# Altium project Sandshark 3D.PrjPcb
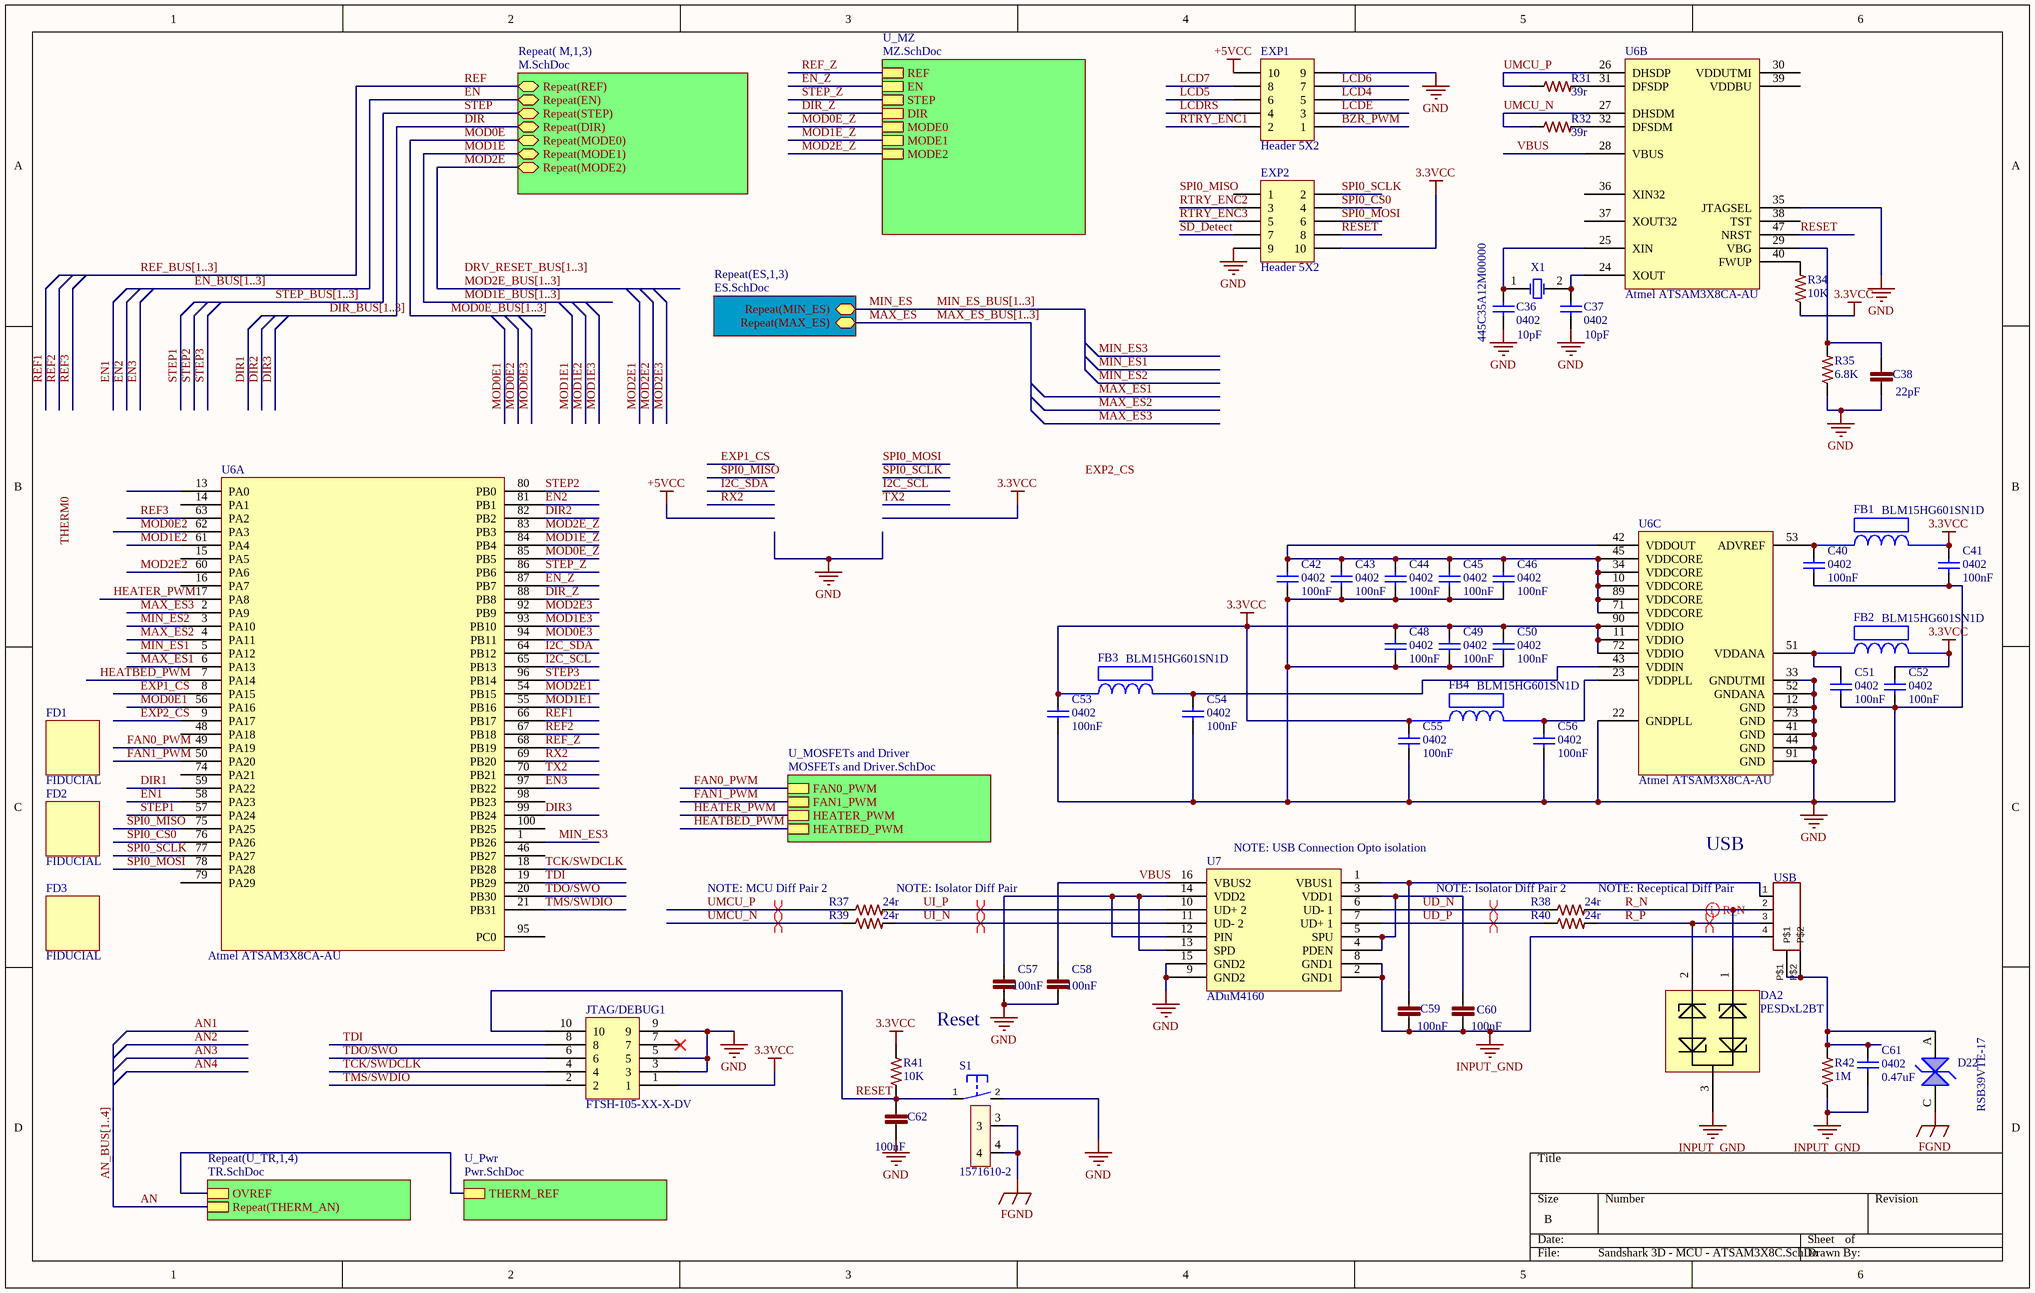
[diagram p0: Sandshark 3D - MCU - ATSAM3X8C.SchDoc]
7 sheets, 281 parts. Net scope: hierarchical (ports join the sheet entries above them; power ports are global).
Board file: Sandshark 3D R1.2.PcbDoc
Sheets:
  Sandshark 3D - MCU - ATSAM3X8C.SchDoc
    U_MZ = MZ.SchDoc
    M1 = M.SchDoc
    M2 = M.SchDoc
    M3 = M.SchDoc
    ES1 = ES.SchDoc
    ES2 = ES.SchDoc
    ES3 = ES.SchDoc
    U_MOSFETs and Driver = MOSFETs and Driver.SchDoc
    U_TR1 = TR.SchDoc
    U_TR2 = TR.SchDoc
    U_TR3 = TR.SchDoc
    U_TR4 = TR.SchDoc
    U_Pwr = Pwr.SchDoc

## Sheet Sandshark 3D - MCU - ATSAM3X8C.SchDoc
size B

### Parts
C36  0402  value 10pF  [C0402]
C37  0402  value 10pF  [C0402]
C38  22pF  [C0402]
C40  value 100nF  [C0402]  (hidden comment: 0402)
C41  value 100nF  [C0402]  (hidden comment: 0402)
C42  value 100nF  [C0402]  (hidden comment: 0402)
C43  value 100nF  [C0402]  (hidden comment: 0402)
C44  value 100nF  [C0402]  (hidden comment: 0402)
C45  value 100nF  [C0402]  (hidden comment: 0402)
C46  value 100nF  [C0402]  (hidden comment: 0402)
C48  value 100nF  [C0402]  (hidden comment: 0402)
C49  value 100nF  [C0402]  (hidden comment: 0402)
C50  value 100nF  [C0402]  (hidden comment: 0402)
C51  value 100nF  [C0402]  (hidden comment: 0402)
C52  value 100nF  [C0402]  (hidden comment: 0402)
C53  value 100nF  [C0402]  (hidden comment: 0402)
C54  value 100nF  [C0402]  (hidden comment: 0402)
C55  value 100nF  [C0402]  (hidden comment: 0402)
C56  value 100nF  [C0402]  (hidden comment: 0402)
C57  100nF  [C0402]
C58  100nF  [C0402]
C59  100nF  [C0402]
C60  100nF  [C0402]
C61  value 0.47uF  [C0402]  (hidden comment: 0402)
C62  100nF  [C0402]
D22  RSB39VTE-17  [SOD323-R]
DA2  PESDxL2BT  [SOT95P230X110-3N]
EXP1  Header 5X2  [HDR2X5]
EXP2  Header 5X2  [HDR2X5]
FB1  BLM15HG601SN1D  [BLM18PG121SN1D]
FB2  BLM15HG601SN1D  [BLM18PG121SN1D]
FB3  BLM15HG601SN1D  [BLM18PG121SN1D]
FB4  BLM15HG601SN1D  [BLM18PG121SN1D]
FD1  FIDUCIAL  [FIDUCIAL-1X2]
FD2  FIDUCIAL  [FIDUCIAL-1X2]
FD3  FIDUCIAL  [FIDUCIAL-1X2]
JTAG/DEBUG1  FTSH-105-XX-X-DV  [FTSH-105-XX-X-DV]
R31  39r  [R0402]
R32  39r  [R0402]
R34  10K  [R0603]
R35  6.8K  [R0402]
R37  24r  [R0603]
R38  24r  [R0603]
R39  24r  [R0603]
R40  24r  [R0603]
R41  10K  [R0603]
R42  1M  [R0402]
S1  1571610-2  [B3F-31XX]
U6  Atmel ATSAM3X8CA-AU  [ATSAM3X8CA-AU TQFP100]  (parts A,B,C of 3)
U7  ADuM4160  [ADUM4160BRWZ-RL]
USB  USB-B  [PN61729]  (value not drawn)
X1  445C35A12M00000  [445C35A12M00000]

### Sub-sheets
Repeat( M,1,3) = M.SchDoc: Repeat(REF), Repeat(EN), Repeat(STEP), Repeat(DIR), Repeat(MODE0), Repeat(MODE1), Repeat(MODE2)
Repeat(ES,1,3) = ES.SchDoc: Repeat(MAX_ES), Repeat(MIN_ES)
Repeat(U_TR,1,4) = TR.SchDoc: OVREF, Repeat(THERM_AN)
U_MOSFETs and Driver = MOSFETs and Driver.SchDoc: FAN0_PWM, FAN1_PWM, HEATER_PWM, HEATBED_PWM
U_MZ = MZ.SchDoc: REF, EN, STEP, DIR, MODE0, MODE1, MODE2
U_Pwr = Pwr.SchDoc: THERM_REF

### Nets
3.3VCC: C41.2 C48.2 C49.2 C50.2 C52.2 C53.2 C55.2 EXP2.10 FB1.2 FB2.2 FB3.1 FB4.1 JTAG/DEBUG1.1 R34.1 R41.2 U6.11(VDDIO) U6.72(VDDIO) U6.90(VDDIO)
+5VCC: EXP1.10
FGND: D22.C S1.3 S1.4
GND: C36.1 C37.1 C38.2 C40.1 C41.1 C42.1 C43.1 C44.1 C45.1 C46.1 C48.1 C49.1 C50.1 C51.1 C52.1 C53.1 C54.1 C55.1 C56.1 C57.2 C58.2 C62.2 EXP1.9 EXP2.9 JTAG/DEBUG1.3 JTAG/DEBUG1.5 JTAG/DEBUG1.9 R35.1 S1.2(S) U6.12(GND) U6.22(GNDPLL) U6.33(GNDUTMI) U6.35(JTAGSEL) U6.41(GND) U6.44(GND) U6.52(GNDANA) U6.73(GND) U6.91(GND) U7.9(GND2) U7.15(GND2)
INPUT_GND: C59.2 C60.2 C61.1 DA2.3 R42.1 U7.2(GND1) U7.8(GND1) USB.4
AN: sheet Repeat(U_TR,1,4)/Repeat(THERM_AN)
BZR_PWM: EXP1.1
DIR: sheet Repeat( M,1,3)/Repeat(DIR)
DIR1: U6.59(PA22)
DIR2: U6.82(PB2)
DIR3: U6.99(PB24)
DIR_Z: U6.88(PB8) ; sheet U_MZ/DIR
EN: sheet Repeat( M,1,3)/Repeat(EN)
EN1: U6.58(PA23)
EN2: U6.81(PB1)
EN3: U6.97(PB22)
EN_Z: U6.87(PB7) ; sheet U_MZ/EN
EXP1_CS: U6.8(PA15)
EXP2_CS: U6.9(PA17)
FAN0_PWM: U6.49(PA19) ; sheet U_MOSFETs and Driver/FAN0_PWM
FAN1_PWM: U6.50(PA20) ; sheet U_MOSFETs and Driver/FAN1_PWM
HEATBED_PWM: U6.7(PA14) ; sheet U_MOSFETs and Driver/HEATBED_PWM
HEATER_PWM: U6.17(PA8) ; sheet U_MOSFETs and Driver/HEATER_PWM
I2C_SCL: U6.65(PB13)
I2C_SDA: U6.64(PB12)
LCD4: EXP1.5
LCD5: EXP1.6
LCD6: EXP1.7
LCD7: EXP1.8
LCDE: EXP1.3
LCDRS: EXP1.4
MAX_ES: sheet Repeat(ES,1,3)/Repeat(MAX_ES)
MAX_ES1: U6.6(PA13)
MAX_ES2: U6.4(PA11)
MAX_ES3: U6.2(PA9)
MIN_ES: sheet Repeat(ES,1,3)/Repeat(MIN_ES)
MIN_ES1: U6.5(PA12)
MIN_ES2: U6.3(PA10)
MIN_ES3: U6.1(PB26)
MOD0E: sheet Repeat( M,1,3)/Repeat(MODE0)
MOD0E1: U6.56(PA16)
MOD0E2: U6.62(PA3)
MOD0E3: U6.94(PB11)
MOD0E_Z: U6.85(PB5) ; sheet U_MZ/MODE0
MOD1E: sheet Repeat( M,1,3)/Repeat(MODE1)
MOD1E1: U6.55(PB16)
MOD1E2: U6.61(PA4)
MOD1E3: U6.93(PB10)
MOD1E_Z: U6.84(PB4) ; sheet U_MZ/MODE1
MOD2E: sheet Repeat( M,1,3)/Repeat(MODE2)
MOD2E1: U6.54(PB15)
MOD2E2: U6.60(PA6)
MOD2E3: U6.92(PB9)
MOD2E_Z: U6.83(PB3) ; sheet U_MZ/MODE2
R_N: DA2.1 R38.2 USB.2
R_P: DA2.2 R40.2 USB.3
REF: sheet Repeat( M,1,3)/Repeat(REF)
REF1: U6.66(PB17)
REF2: U6.67(PB18)
REF3: U6.63(PA2)
REF_Z: U6.68(PB19) ; sheet U_MZ/REF
RESET: C62.1 EXP2.8 JTAG/DEBUG1.10 R41.1 S1.1(P) U6.47(NRST)
RTRY_ENC1: EXP1.2
RTRY_ENC2: EXP2.3
RTRY_ENC3: EXP2.5
RX2: U6.69(PB20)
SD_Detect: EXP2.7
SPI0_CS0: EXP2.4 U6.76(PA26)
SPI0_MISO: U6.75(PA25)
SPI0_MOSI: EXP2.6 U6.78(PA28)
SPI0_SCLK: EXP2.2 U6.77(PA27)
STEP: sheet Repeat( M,1,3)/Repeat(STEP)
STEP1: U6.57(PA24)
STEP2: U6.80(PB0)
STEP3: U6.96(PB14)
STEP_Z: U6.86(PB6) ; sheet U_MZ/STEP
TCK/SWDCLK: JTAG/DEBUG1.4 U6.18(PB28)
TDI: JTAG/DEBUG1.8 U6.19(PB29)
TDO/SWO: JTAG/DEBUG1.6 U6.20(PB30)
TMS/SWDIO: JTAG/DEBUG1.2 U6.21(PB31)
TX2: U6.70(PB21)
UD_N: R38.1 U7.6(UD-_1)
UD_P: R40.1 U7.7(UD+_1)
UI_N: R39.2 U7.11(UD-_2)
UI_P: R37.2 U7.10(UD+_2)
UMCU_N: R32.1 R39.1 U6.27(DHSDM)
UMCU_P: R31.1 R37.1 U6.26(DHSDP)
VBUS: C58.1 U6.28(VBUS) U7.16(VBUS2)
NetC36_2: C36.2 U6.25(XIN) X1.1(OSC1)
NetC37_2: C37.2 U6.24(XOUT) X1.2(OSC2)
NetC38_1: C38.1 R35.2 U6.29(VBG)
NetC40_2: C40.2 FB1.1 U6.53(ADVREF)
NetC42_2: C42.2 C43.2 C44.2 C45.2 C46.2 U6.10(VDDCORE) U6.34(VDDCORE) U6.42(VDDOUT) U6.45(VDDCORE) U6.71(VDDCORE) U6.89(VDDCORE)
NetC51_2: C51.2 FB2.1 U6.51(VDDANA)
NetC54_2: C54.2 FB3.2 U6.43(VDDIN)
NetC56_2: C56.2 FB4.2 U6.23(VDDPLL)
NetC57_1: C57.1 U7.12(PIN) U7.13(SPD) U7.14(VDD2)
NetC59_1: C59.1 U7.1(VBUS1) USB.1
NetC60_1: C60.1 U7.3(VDD1) U7.4(PDEN) U7.5(SPU)
NetC61_2: C61.2 D22.A R42.2 USB.P$1 USB.P$2
NetD18_C: sheet Repeat(U_TR,1,4)/OVREF, sheet U_Pwr/THERM_REF
NetR31_2: R31.2 U6.31(DFSDP)
NetR32_2: R32.2 U6.32(DFSDM)
NetR34_2: R34.2 U6.40(FWUP)

Not connected (* = marked no-connect by the designer): EXP2 1; JTAG/DEBUG1 7*; U6 13(PA0) 14(PA1) 15(PA5) 16(PA7) 30(VDDUTMI) 36(XIN32) 37(XOUT32) 38(TST) 39(VDDBU) 46(PB27) 48(PA18) 74(PA21) 79(PA29) 95(PC0) 98(PB23) 100(PB25)

### Buses and harness runs
bus AN_BUS[1..4]
bus DIR_BUS[1..3]
bus DRV_RESET_BUS[1..3]
bus EN_BUS[1..3]
bus MAX_ES_BUS[1..3]
bus MIN_ES_BUS[1..3]
bus MOD0E_BUS[1..3]
bus MOD1E_BUS[1..3]
bus MOD2E_BUS[1..3]
bus REF_BUS[1..3]
bus STEP_BUS[1..3]

### Layout directives
differential pair: R_N, R_P, UD_N, UD_P, UI_N, UI_P, UMCU_N, UMCU_P

### Notes on the sheet
- NOTE: MCU Diff Pair 2
- NOTE: Isolator Diff Pair
- (near U7) NOTE: USB Connection Opto isolation
- (near R38) NOTE: Isolator Diff Pair 2
- NOTE: Receptical Diff Pair
- USB
- (near C57) Reset
- Labels drawn without touching a wire or pin: DRV_RESET_BUS[1..3], EXP2_CS, SPI0_MISO, THERM0

### Library data of the parts
C36 C37 = CL05C100JB5NNNC: CAP CER 10PF 50V 5% NP0 0402; MFR: Samsung; Tolerance: 10%; Voltage: 50VDC; Published: 10 - Dec - 2014; LatestRevisionDate: 10 - Dec - 2014; LatestRevisionNote: Ultimachine Footprint Added; Publisher: Ultimachine; Component Type: Chip Capacitor; MFR Part #: CL05C100JB5NNNC; Part Description: CAP CER 10PF 50V 5% NP0 0402; Mounting Type: SMT 0402; Datasheet: http://www.samsungsem.com/kr/front/downloadcms.do?path=/kr/support/product-search/mlcc/__icsFiles/afieldfile/2014/11/05&fileName=S_CL05C100JB5NNNC.pdf; Height: 0.55mm; PackageReference: 0402
C38 = 04025A220JAT2A: CAP CER 0402 22pF 50V 5% C0G; LastRevisionNote: ImportComponents; Published: 23-Apr-2014; Publisher: UltiMachine; LastRevisionDate: 23-Apr-2014; ManufacturerPartNumber: 04025A220JAT2A; VALUE: 22pF
C40-C46 C48-C56 = GRM155R71C104KA88D: CAP CER 0.1UF (100nF) 16V 10% X7R 0402; MFR: Murata; Part Description: CAP CER 0.1UF 16V 10% X7R 0402; Published: 10 - Dec - 2014; LatestRevisionDate: 10 - Dec - 2014; LatestRevisionNote: Ultimachine Footprint Added; Publisher: Ultimachine; Component Type: Chip Capacitor; MFR Part #: GRM155R71C104KA88D; Mounting Type: SMT 0402; Datasheet: http://psearch.murata.com/capacitor/product/GRM155R71C104KA88%23.pdf; Height: 0.5 ±0.05mm; Tolerance: 10%; Voltage: 16v; PackageReference: 0402
C57-C60 C62 = GRM155R71C104KA88D: CAP CER 0402 100nF 16V 10% X7R; LastRevisionNote: ImportComponents; Published: 23-Apr-2014; Publisher: UltiMachine; LastRevisionDate: 23-Apr-2014; ManufacturerPartNumber: GRM155R71C104KA88D; VALUE: 100nF
C61 = GRM155R60J474KE19D: 0.47uF 6.3v C0402 - GRM155R60J474KE19D; MFR: Murata; Part Description: CAP CER 0.47UF 6.3V 10% X5R 0402; Tolerance: 10%; Voltage: 6.3VDC; Published: 10 - Dec - 2014; LatestRevisionDate: 10 - Dec - 2014; LatestRevisionNote: Ultimachine Footprint Added; Publisher: Ultimachine; Component Type: Chip Capacitor; MFR Part #: GRM155R60J474KE19D; Mounting Type: SMT 0402; Datasheet: http://search.murata.co.jp/Ceramy/image/img/A01X/G101/ENG/GRM155R60J474KE19-01.pdf; Height: 0.5 ±0.05mm; PackageReference: 0402
D22 = RSB39VTE-17: DIODE TVS
DA2 = PESDxL2BT: PESDxL2BT TVS Diode Array 2x
EXP1 EXP2 = Header 5X2: Header, 5-Pin, Dual row; LatestRevisionDate: 17-Jul-2002; LatestRevisionNote: Re-released for DXP Platform.; Publisher: Altium Limited
JTAG/DEBUG1 = ARM Cortex JTAG-DEBUG Header
R31 R32 = ERJ-2RKF39R0X: RES SMD 39 OHM 1% 1/10W 0402; Manufacturer: Panasonic; LastRevisionNote: ImportComponents; Published: 23-Apr-2014; Publisher: UltiMachine; LastRevisionDate: 23-Apr-2014; ManufacturerPartNumber: ERJ-2RKF39R0X; Height: 0.4mm; VALUE: 39r
R34 R41 = ERJ-3EKF1002V: RES 0603 10K 100mW 1%; LastRevisionNote: ImportComponents; Published: 23-Apr-2014; Publisher: UltiMachine; LastRevisionDate: 23-Apr-2014; ManufacturerPartNumber: ERJ-3EKF1002V; VALUE: 10K
R35 = CRCW04026K80FKED: RES SMD 6.8K OHM 1% 1/16W 0402; Manufacturer: Vishay Dale; LastRevisionNote: ImportComponents; Published: 23-Apr-2014; Publisher: UltiMachine; LastRevisionDate: 23-Apr-2014; ManufacturerPartNumber: CRCW04026K80FKED; Height: 0.4mm; VALUE: 6.8K
R37-R40 = RC1608F240CS: RES SMD 24 OHM 1% 1/10W 0603; Manufacturer: Samsung; ManufacturerPartNumber: RC0603FR-07100KL; LastRevisionNote: ImportComponents; Published: 23-Apr-2014; Publisher: UltiMachine; LastRevisionDate: 23-Apr-2014; VALUE: 24r; PDF: http://www.samsungsem.com/global/support/library/product-catalog/__icsFiles/afieldfile/2015/01/12/CHIP_RESISTOR_150112_1.pdf
R42 = ERJ2GEJ105X: RES 0402 1M 100mW 5%; LastRevisionNote: ImportComponents; Published: 23-Apr-2014; Publisher: UltiMachine; LastRevisionDate: 23-Apr-2014; ManufacturerPartNumber: ERJ2GEJ105X; VALUE: 1M
S1 = 1571610-2_1: SWTCH Momentary Washable; Manufacturer: Omron; Manufacturer: TE; LastRevisionNote: Import; ComponentLink1URL: http://www.te.com/commerce/DocumentDelivery/DDEController?Action=srchrtrv&DocNm=1571610&DocType=Customer+Drawing&DocLang=English; ComponentLink1Description: Datasheet for B3F-31XX; Published: 23-Apr-2014; Publisher: UltiMachine; LastRevisionDate: 23-Apr-2014; ManufacturerPartNumber: 1571610-2; Supplier 1: Mouser; Supplier Part Number 1: 506-1571610-2
U6 = ATML-ATSAM3X8CA-AU-LQFP-100: Atmel ARM Cortex M3 MCU ATSAM3X8CA-AU; Manufacture: Atmel; Manufacture Part #: ATSAM3X8CA-AU; Type: ARM Cortex M3 Microcontroller; Mounting Type: SMT TQFP; Package Type: TQFP100; Datasheet: http://www.atmel.com/Images/doc11057s.pdf
U7 = ADuM4160: ADI iCoupler - USB 2.0 Galvanic Isolator
USB = USB-B: USB connector B PTH; LastRevisionNote: ImportComponents; Published: 23-Apr-2014; Publisher: UltiMachine; LastRevisionDate: 23-Apr-2014
X1 = XTAL: Crystal Oscillator; Published: 8-Jun-2000; LatestRevisionDate: 17-Jul-2002; LatestRevisionNote: Re-released for DXP Platform.; PackageReference: R38; Publisher: Altium Limited; PackageDescription: Crystal, Thru-Hole; 2 Leads; Body 3.1 x 8.2 mm (Dia.xH)

## Sheet MZ.SchDoc
size A
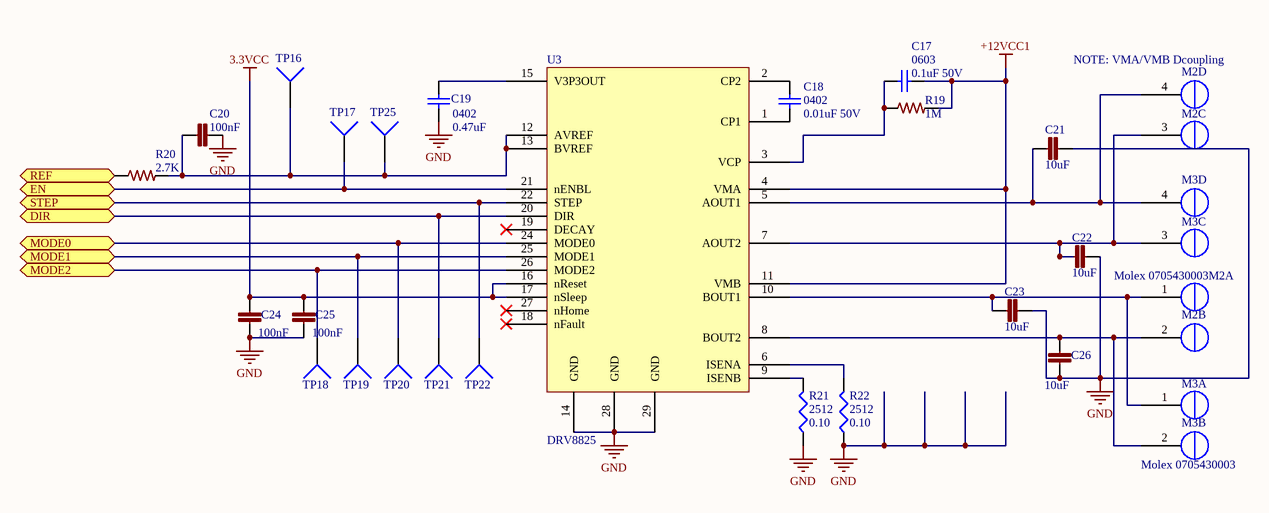
[diagram p1: MZ.SchDoc]

### Parts
C17  0603  value 0.1uF 50V  [1608[0603]]
C18  value 0.01uF 50V  [C0402]  (hidden comment: 0402)
C19  value 0.47uF  [C0402]  (hidden comment: 0402)
C20  100nF  [C0402]
C21  10uF  [C0603]
C22  10uF  [C0603]
C23  10uF  [C0603]
C24  100nF  [C0402]
C25  100nF  [C0402]
C26  10uF  [C0603]
M2  Molex 0705430003  [4POL254]  (parts A,B,C,D of 4)
M3  Molex 0705430003  [4POL254]  (parts A,B,C,D of 4)
R19  1M  [R0402]
R20  2.7K  [R0402]
R21  2512  value 0.10  [2512R-0.55]
R22  2512  value 0.10  [2512R-0.55]
TP16  TP4  [TP-2]  (value not drawn)
TP17  TP4  [TP-2]  (value not drawn)
TP18  TP4  [TP-2]  (value not drawn)
TP19  TP4  [TP-2]  (value not drawn)
TP20  TP4  [TP-2]  (value not drawn)
TP21  TP4  [TP-2]  (value not drawn)
TP22  TP4  [TP-2]  (value not drawn)
TP25  TP4  [TP-2]  (value not drawn)
U3  DRV8825  [DRV8825PWPR]

### Ports
DIR, EN, MODE0, MODE1, MODE2, REF, STEP

### Nets
3.3VCC: C24.1 C25.1 U3.16(nReset) U3.17(nSleep)
+12VCC1: C17.1 R19.2 U3.4(VMA) U3.11(VMB)
GND: C19.1 C20.2 C21.2 C22.2 C23.2 C24.2 C25.2 C26.2 R21.1 R22.1 U3.14(GND) U3.28(GND) U3.29(GND)
DIR_Z: TP21.1 U3.20(DIR) ; port DIR
EN_Z: TP17.1 U3.21(nENBL) ; port EN
MOD0E_Z: TP20.1 U3.24(MODE0) ; port MODE0
MOD1E_Z: TP19.1 U3.25(MODE1) ; port MODE1
MOD2E_Z: TP18.1 U3.26(MODE2) ; port MODE2
REF_Z: R20.1 ; port REF
STEP_Z: TP22.1 U3.22(STEP) ; port STEP
NetC17_2: C17.2 R19.1 U3.3(VCP)
NetC18_1: C18.1 U3.1(CP1)
NetC18_2: C18.2 U3.2(CP2)
NetC19_2: C19.2 U3.15(V3P3OUT)
NetC20_1: C20.1 R20.2 TP16.1 TP25.1 U3.12(AVREF) U3.13(BVREF)
NetC21_1: C21.1 M2.4(OUT1B) M3.4(OUT1B) U3.5(AOUT1)
NetC22_1: C22.1 M2.3(OUT1A) M3.3(OUT1A) U3.7(AOUT2)
NetC23_1: C23.1 M2.1(OUT2B) M3.1(OUT2B) U3.10(BOUT1)
NetC26_1: C26.1 M2.2(OUT2A) M3.2(OUT2A) U3.8(BOUT2)
NetR21_2: R21.2 U3.9(ISENB)
NetR22_2: R22.2 U3.6(ISENA)

Not connected (* = marked no-connect by the designer): U3 18(nFault)* 19(DECAY)* 23(NC) 27(nHome)*

### Notes on the sheet
- (near M2) NOTE: VMA/VMB Dcoupling

### Library data of the parts
C17 = Cap Semi: Capacitor (Semiconductor SIM Model); Published: 8-Jun-2000; LatestRevisionDate: 29-May-2009; LatestRevisionNote: IPC-7351 Footprint Added.; PackageReference: C1206; Publisher: Altium Limited; PackageDescription: Chip Capacitor
C18 = GRM155R71H103JA88D: CAP CER 10000PF 50V X7R 0402; MFR: Murata; Tolerance: 10%; Voltage: 6.3VDC; Published: 10 - Dec - 2014; LatestRevisionDate: 10 - Dec - 2014; LatestRevisionNote: Ultimachine Footprint Added; Publisher: Ultimachine; Component Type: Chip Capacitor; MFR Part #: GRM155R71H103JA88D; Part Description: CAP CER 10000PF 50V X7R 0402; Mounting Type: SMT 0402; Datasheet: http://search.murata.co.jp/Ceramy/image/img/A01X/G101/ENG/GRM155R71H103JA88-01.pdf; Height: 0.5 ±0.05mm; Digikey #: 490-7763-1-ND; PackageReference: 0402
C19 = GRM155R60J474KE19D: as C61 on sheet Sandshark 3D - MCU - ATSAM3X8C; Published: 10 - Dec - 2014; LatestRevisionDate: 10 - Dec - 2014; LatestRevisionNote: Ultimachine Footprint Added; Publisher: Ultimachine; Component Type: Chip Capacitor; MFR Part #: GRM155R60J474KE19D; Mounting Type: SMT 0402; Datasheet: http://search.murata.co.jp/Ceramy/image/img/A01X/G101/ENG/GRM155R60J474KE19-01.pdf; Height: 0.5 ±0.05mm; PackageReference: 0402
C20 C24 C25 = GRM155R71C104KA88D: as C57 on sheet Sandshark 3D - MCU - ATSAM3X8C; Published: 23-Apr-2014; Publisher: UltiMachine; LastRevisionDate: 23-Apr-2014; ManufacturerPartNumber: GRM155R71C104KA88D; VALUE: 100nF
C21-C23 C26 = CC0603ZRY5V6BB105: CAP CER 0603 1uF 10V Y5V; LastRevisionNote: ImportComponents; Published: 23-Apr-2014; Publisher: UltiMachine; LastRevisionDate: 23-Apr-2014; ManufacturerPartNumber: CC0603ZRY5V6BB105; VALUE: 10uF
M2 M3 = Molex 0705430003 Alt: Molex 4 Pin Clip Connector
R19 = ERJ2GEJ105X: as R42 on sheet Sandshark 3D - MCU - ATSAM3X8C; Published: 23-Apr-2014; Publisher: UltiMachine; LastRevisionDate: 23-Apr-2014; ManufacturerPartNumber: ERJ2GEJ105X; VALUE: 1M
R20 = ERJ-2RKF2701X: RES SMD 2.7K OHM 1% 1/10W 0402; Manufacturer: Panasonic; ManufacturerPartNumber: ERJ2GEJ105X; LastRevisionNote: ImportComponents; Published: 23-Apr-2014; Publisher: Adam; LastRevisionDate: 23-Apr-2014; VALUE: 2.7K
R21 R22 = CSRN2512FTR100: RES SMD 0.1 OHM 1% 2W 2512; MFR: Stackpole ELectronics Inc; PackageReference: 2512; MFR #: CSRN2512FTR100; Digikey #: CSRN2512FTR100TR-ND; PDF: http://www.seielect.com/catalog/SEI-CSR_CSRN.pdf
TP16-TP22 TP25 = Socket: LatestRevisionDate: 17-Jul-2002; LatestRevisionNote: Re-released for DXP Platform.; Publisher: Altium Limited
U3 = DRV8825: DRV8825 Ti Stepper Driver; Manufacture: Texas Instruments; Mountining Type: SMD - Ti PowerPAD Package; Voltage: 8.2-45VDC; Cost (1000 qty): 2.25; Part Number: DRV8825PWPR; Status: In-Production; Pins: 28 Pins and one Exposed Pad; Datasheet: http://www.ti.com/lit/gpn/drv8825; Height: 1.2mm; Tolerance: N/A; Type: Stepper Driver - Integrated Circuit; Lead Free: YES

## Sheet M.SchDoc
size A
Used 3 times, as channels M1, M2, M3. Parts and nets are listed once, with the designators drawn on the sheet.
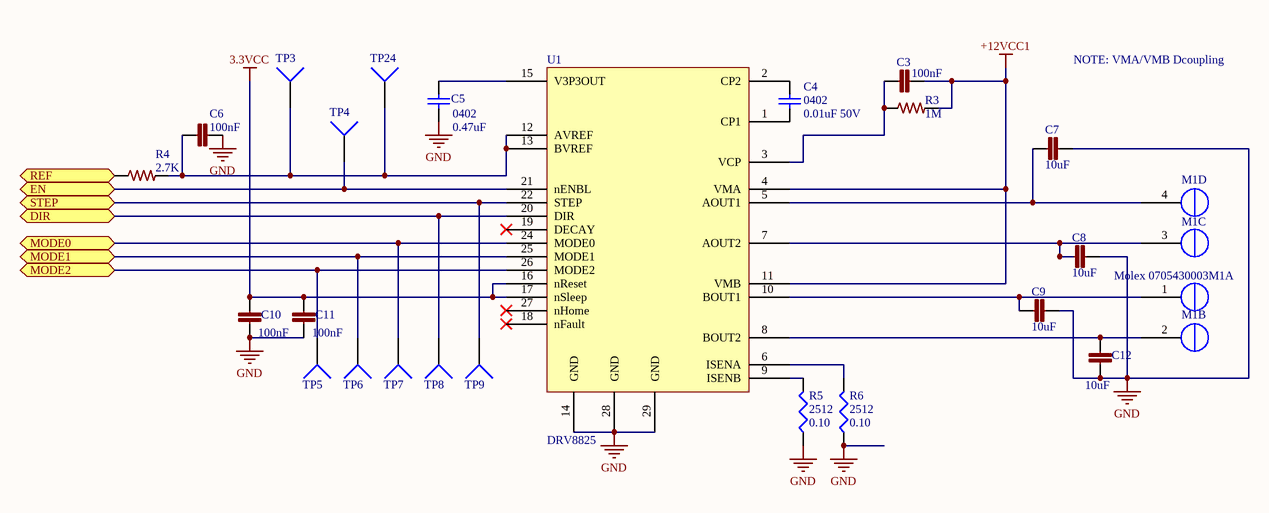
[diagram p2: M.SchDoc]

### Parts
C3  100nF  [C0603]
C4  value 0.01uF 50V  [C0402]  (hidden comment: 0402)
C5  value 0.47uF  [C0402]  (hidden comment: 0402)
C6  100nF  [C0402]
C7  10uF  [C0603]
C8  10uF  [C0603]
C9  10uF  [C0603]
C10  100nF  [C0402]
C11  100nF  [C0402]
C12  10uF  [C0603]
M1  Molex 0705430003  [4POL254]  (parts A,B,C,D of 4)
R3  1M  [R0402]
R4  2.7K  [R0402]
R5  2512  value 0.10  [2512R-0.55]
R6  2512  value 0.10  [2512R-0.55]
TP3  TP4  [TP-2]  (value not drawn)
TP4  TP4  [TP-2]  (value not drawn)
TP5  TP4  [TP-2]  (value not drawn)
TP6  TP4  [TP-2]  (value not drawn)
TP7  TP4  [TP-2]  (value not drawn)
TP8  TP4  [TP-2]  (value not drawn)
TP9  TP4  [TP-2]  (value not drawn)
TP24  TP4  [TP-2]  (value not drawn)
U1  DRV8825  [DRV8825PWPR]

### Ports
DIR, EN, MODE0, MODE1, MODE2, REF, STEP

### Nets
3.3VCC: C10.1 C11.1 U1.16(nReset) U1.17(nSleep)
+12VCC1: C3.2 R3.2 U1.4(VMA) U1.11(VMB)
GND: C5.1 C6.1 C7.2 C8.2 C9.2 C10.2 C11.2 C12.2 R5.1 R6.1 U1.14(GND) U1.28(GND) U1.29(GND)
DIR: TP8.1 U1.20(DIR) ; port DIR
EN: TP4.1 U1.21(nENBL) ; port EN
MODE0: TP7.1 U1.24(MODE0) ; port MODE0
MODE1: TP6.1 U1.25(MODE1) ; port MODE1
MODE2: TP5.1 U1.26(MODE2) ; port MODE2
REF: R4.1 ; port REF
STEP: TP9.1 U1.22(STEP) ; port STEP
NetC3_1: C3.1 R3.1 U1.3(VCP)
NetC4_1: C4.1 U1.1(CP1)
NetC4_2: C4.2 U1.2(CP2)
NetC5_2: C5.2 U1.15(V3P3OUT)
NetC6_2: C6.2 R4.2 TP3.1 TP24.1 U1.12(AVREF) U1.13(BVREF)
NetC7_1: C7.1 M1.4(OUT1B) U1.5(AOUT1)
NetC8_1: C8.1 M1.3(OUT1A) U1.7(AOUT2)
NetC9_1: C9.1 M1.1(OUT2B) U1.10(BOUT1)
NetC12_1: C12.1 M1.2(OUT2A) U1.8(BOUT2)
NetR5_2: R5.2 U1.9(ISENB)
NetR6_2: R6.2 U1.6(ISENA)

Not connected (* = marked no-connect by the designer): U1 18(nFault)* 19(DECAY)* 23(NC) 27(nHome)*

### Channels
M1: designators end in _M1; ports DIR=DIR1 EN=EN1 MODE0=MOD0E1 MODE1=MOD1E1 MODE2=MOD2E1 REF=REF1 STEP=STEP1
M2: designators end in _M2; ports DIR=DIR2 EN=EN2 MODE0=MOD0E2 MODE1=MOD1E2 MODE2=MOD2E2 REF=REF2 STEP=STEP2
M3: designators end in _M3; ports DIR=DIR3 EN=EN3 MODE0=MOD0E3 MODE1=MOD1E3 MODE2=MOD2E3 REF=REF3 STEP=STEP3

### Notes on the sheet
- NOTE: VMA/VMB Dcoupling

### Library data of the parts
C3 = C0603C104K5RACTU: CAP CER 0603 100nF 50V 10% X7R; LastRevisionNote: ImportComponents; Published: 23-Apr-2014; Publisher: UltiMachine; LastRevisionDate: 23-Apr-2014; ManufacturerPartNumber: C0603C104K5RACTU; VALUE: 100nF
C4 = GRM155R71H103JA88D: as C18 on sheet MZ; Published: 10 - Dec - 2014; LatestRevisionDate: 10 - Dec - 2014; LatestRevisionNote: Ultimachine Footprint Added; Publisher: Ultimachine; Component Type: Chip Capacitor; MFR Part #: GRM155R71H103JA88D; Part Description: CAP CER 10000PF 50V X7R 0402; Mounting Type: SMT 0402; Datasheet: http://search.murata.co.jp/Ceramy/image/img/A01X/G101/ENG/GRM155R71H103JA88-01.pdf; Height: 0.5 ±0.05mm; Digikey #: 490-7763-1-ND; PackageReference: 0402
C5 = GRM155R60J474KE19D: as C61 on sheet Sandshark 3D - MCU - ATSAM3X8C; Published: 10 - Dec - 2014; LatestRevisionDate: 10 - Dec - 2014; LatestRevisionNote: Ultimachine Footprint Added; Publisher: Ultimachine; Component Type: Chip Capacitor; MFR Part #: GRM155R60J474KE19D; Mounting Type: SMT 0402; Datasheet: http://search.murata.co.jp/Ceramy/image/img/A01X/G101/ENG/GRM155R60J474KE19-01.pdf; Height: 0.5 ±0.05mm; PackageReference: 0402
C6 C10 C11 = GRM155R71C104KA88D: as C57 on sheet Sandshark 3D - MCU - ATSAM3X8C; Published: 23-Apr-2014; Publisher: UltiMachine; LastRevisionDate: 23-Apr-2014; ManufacturerPartNumber: GRM155R71C104KA88D; VALUE: 100nF
C7-C9 C12 = CC0603ZRY5V6BB105: as C21 on sheet MZ; Published: 23-Apr-2014; Publisher: UltiMachine; LastRevisionDate: 23-Apr-2014; ManufacturerPartNumber: CC0603ZRY5V6BB105; VALUE: 10uF
M1 = Molex 0705430003 Alt: Molex 4 Pin Clip Connector
R3 = ERJ2GEJ105X: as R42 on sheet Sandshark 3D - MCU - ATSAM3X8C; Published: 23-Apr-2014; Publisher: UltiMachine; LastRevisionDate: 23-Apr-2014; ManufacturerPartNumber: ERJ2GEJ105X; VALUE: 1M
R4 = ERJ-2RKF2701X: as R20 on sheet MZ; Published: 23-Apr-2014; Publisher: Adam; LastRevisionDate: 23-Apr-2014; VALUE: 2.7K
R5 R6 = CSRN2512FTR100: as R21 on sheet MZ; PackageReference: 2512; MFR #: CSRN2512FTR100; Digikey #: CSRN2512FTR100TR-ND; PDF: http://www.seielect.com/catalog/SEI-CSR_CSRN.pdf
TP3-TP9 TP24 = Socket: LatestRevisionDate: 17-Jul-2002; LatestRevisionNote: Re-released for DXP Platform.; Publisher: Altium Limited
U1 = DRV8825: as U3 on sheet MZ; Part Number: DRV8825PWPR; Status: In-Production; Pins: 28 Pins and one Exposed Pad; Datasheet: http://www.ti.com/lit/gpn/drv8825; Height: 1.2mm; Tolerance: N/A; Type: Stepper Driver - Integrated Circuit; Lead Free: YES

## Sheet ES.SchDoc
size A
Used 3 times, as channels ES1, ES2, ES3. Parts and nets are listed once, with the designators drawn on the sheet.
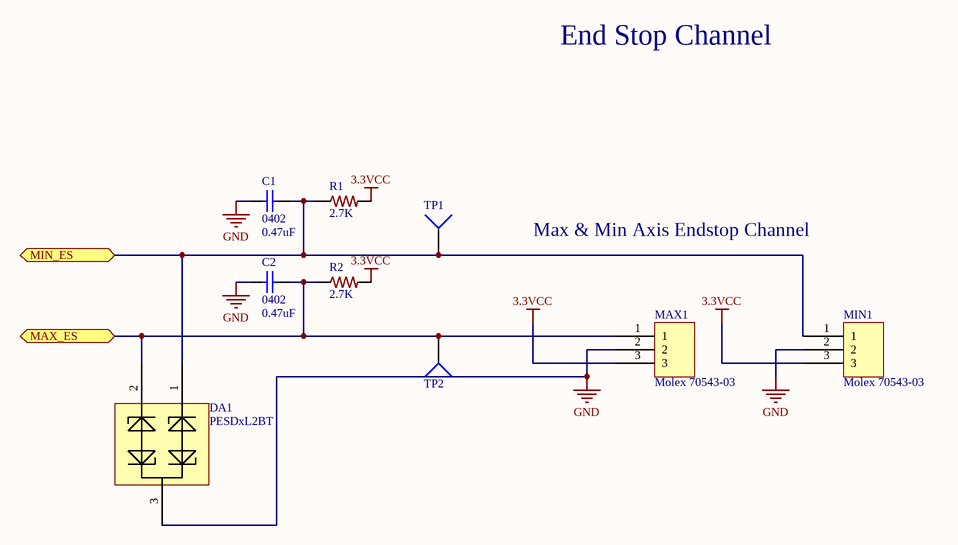
[diagram p3: ES.SchDoc]

### Parts
C1  value 0.47uF  [C0402]  (hidden comment: 0402)
C2  value 0.47uF  [C0402]  (hidden comment: 0402)
DA1  PESDxL2BT  [SOT95P230X110-3N]
MAX1  Molex 70543-03  [70543-03]
MIN1  Molex 70543-03  [70543-03]
R1  2.7K  [R0402]
R2  2.7K  [R0402]
TP1  TP4  [TP-2]  (value not drawn)
TP2  TP4  [TP-2]  (value not drawn)

### Ports
MAX_ES, MIN_ES

### Nets
3.3VCC: MAX1.3 MIN1.3 R1.2 R2.2
GND: C1.2 C2.2 DA1.3 MAX1.2 MIN1.2
MAX_ES: C2.1 DA1.2 MAX1.1 R2.1 TP2.1 ; port MAX_ES
MIN_ES: C1.1 DA1.1 MIN1.1 R1.1 TP1.1 ; port MIN_ES

### Channels
ES1: designators end in _ES1; ports MAX_ES=MAX_ES1 MIN_ES=MIN_ES1
ES2: designators end in _ES2; ports MAX_ES=MAX_ES2 MIN_ES=MIN_ES2
ES3: designators end in _ES3; ports MAX_ES=MAX_ES3 MIN_ES=MIN_ES3

### Notes on the sheet
- End Stop Channel
- Max & Min Axis Endstop Channel

### Library data of the parts
C1 C2 = GRM155R60J474KE19D: as C61 on sheet Sandshark 3D - MCU - ATSAM3X8C; Published: 10 - Dec - 2014; LatestRevisionDate: 10 - Dec - 2014; LatestRevisionNote: Ultimachine Footprint Added; Publisher: Ultimachine; Component Type: Chip Capacitor; MFR Part #: GRM155R60J474KE19D; Mounting Type: SMT 0402; Datasheet: http://search.murata.co.jp/Ceramy/image/img/A01X/G101/ENG/GRM155R60J474KE19-01.pdf; Height: 0.5 ±0.05mm; PackageReference: 0402
DA1 = PESDxL2BT: PESDxL2BT TVS Diode Array 2x
MAX1 MIN1 = Molex Endstop
R1 R2 = ERJ-2GEJ272X: RES SMD 2.7K OHM 5% 1/10W 0402; LastRevisionNote: ImportComponents; Published: 23-Apr-2014; Publisher: Adam Vadala-Roth; LastRevisionDate: 23-Apr-2014; ManufacturerPartNumber: ERJ-2GEJ272X; Digikey #: P2.7KJCT-ND; Tolerance: 5%; Mounting type: SMD; VALUE: 2.7K
TP1 TP2 = Socket: LatestRevisionDate: 17-Jul-2002; LatestRevisionNote: Re-released for DXP Platform.; Publisher: Altium Limited

## Sheet MOSFETs and Driver.SchDoc
size A
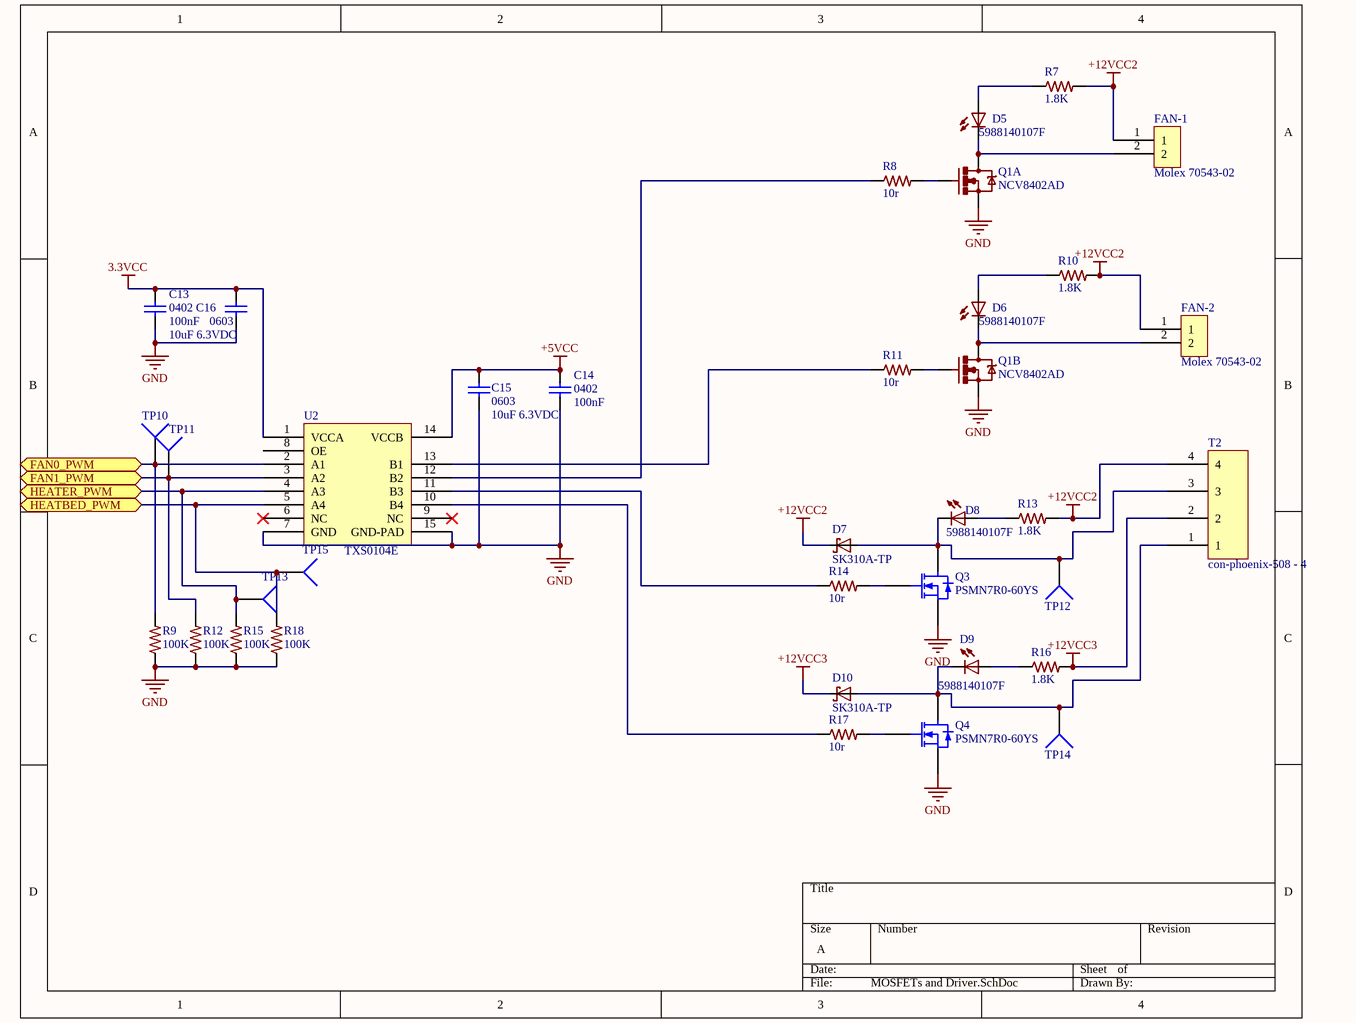
[diagram p4: MOSFETs and Driver.SchDoc]

### Parts
C13  value 100nF  [C0402]  (hidden comment: 0402)
C14  value 100nF  [C0402]  (hidden comment: 0402)
C15  0603  value 10uF 6.3VDC  [C0603]
C16  0603  value 10uF 6.3VDC  [C0603]
D5  5988140107F  [LED2012120]
D6  5988140107F  [LED2012120]
D7  SK310A-TP  [SMA-SM]
D8  5988140107F  [LED2012120]
D9  5988140107F  [LED2012120]
D10  SK310A-TP  [SMA-SM]
FAN-1  Molex 70543-02  [70543-02]
FAN-2  Molex 70543-02  [70543-02]
Q1  NCV8402AD  [NCV8402AD-SOIC8]  (parts A,B of 2)
Q3  PSMN7R0-60YS  [PSMN7R0-60YS]
Q4  PSMN7R0-60YS  [PSMN7R0-60YS]
R7  1.8K  [R0603]
R8  10r  [R0603]
R9  100K  [R0402]
R10  1.8K  [R0603]
R11  10r  [R0603]
R12  100K  [R0402]
R13  1.8K  [R0603]
R14  10r  [R0603]
R15  100K  [R0402]
R16  1.8K  [R0603]
R17  10r  [R0603]
R18  100K  [R0402]
T2  con-phoenix-508 - 4  [MSTBV4]
TP10  TP4  [TP-2]  (value not drawn)
TP11  TP4  [TP-2]  (value not drawn)
TP12  TP4  [TP-2]  (value not drawn)
TP13  TP4  [TP-2]  (value not drawn)
TP14  TP4  [TP-2]  (value not drawn)
TP15  TP4  [TP-2]  (value not drawn)
U2  TXS0104E  [RGY  (S-PVQFN-N14)]

### Ports
FAN0_PWM, FAN1_PWM, HEATBED_PWM, HEATER_PWM

### Nets
3.3VCC: C13.2 C16.2 U2.1(VCCA)
+5VCC: C14.2 C15.2 U2.14(VCCB)
+12VCC2: D7.C FAN-1.1 FAN-2.1 R7.2 R10.2 R13.2 T2.4
+12VCC3: D10.C R16.2 T2.2
GND: C13.1 C14.1 C15.1 C16.1 Q1.1(S) Q1.3(S) Q3.1(S) Q3.2(S) Q3.3(S) Q4.1(S) Q4.2(S) Q4.3(S) R9.1 R12.1 R15.1 R18.1 U2.7(GND) U2.15(GND-PAD)
FAN0_PWM: R9.2 TP10.1 U2.2(A1) ; port FAN0_PWM
FAN1_PWM: R12.2 TP11.1 U2.3(A2) ; port FAN1_PWM
HEATBED_PWM: R18.2 TP15.1 U2.5(A4) ; port HEATBED_PWM
HEATER_PWM: R15.2 TP13.1 U2.4(A3) ; port HEATER_PWM
NetD5_A: D5.A R7.1
NetD5_C: D5.C FAN-1.2 Q1.7(D)
NetD6_A: D6.A R10.1
NetD6_C: D6.C FAN-2.2 Q1.5(D)
NetD7_A: D7.A D8.C Q3.5(D) T2.3 TP12.1
NetD8_A: D8.A R13.1
NetD9_A: D9.A R16.1
NetD9_C: D9.C D10.A Q4.5(D) T2.1 TP14.1
NetQ1_2: Q1.2(G) R8.2
NetQ1_4: Q1.4(G) R11.2
NetQ3_4: Q3.4(G) R14.2
NetQ4_4: Q4.4(G) R17.2
NetR8_1: R8.1 U2.12(B2)
NetR11_1: R11.1 U2.13(B1)
NetR14_1: R14.1 U2.11(B3)
NetR17_1: R17.1 U2.10(B4)

Not connected (* = marked no-connect by the designer): U2 6(NC)* 8(OE) 9(NC)*

### Library data of the parts
C13 C14 = GRM155R71C104KA88D: as C40 on sheet Sandshark 3D - MCU - ATSAM3X8C; Published: 10 - Dec - 2014; LatestRevisionDate: 10 - Dec - 2014; LatestRevisionNote: Ultimachine Footprint Added; Publisher: Ultimachine; Component Type: Chip Capacitor; MFR Part #: GRM155R71C104KA88D; Mounting Type: SMT 0402; Datasheet: http://psearch.murata.com/capacitor/product/GRM155R71C104KA88%23.pdf; Height: 0.5 ±0.05mm; Tolerance: 10%; Voltage: 16v; PackageReference: 0402
C15 C16 = C1608JB0J106K080AB: CAP CER 10UF 6.3V 10% JB 0603; MFR: TDK; Voltage: 6.3VDC; Published: 10 - Dec - 2014; LatestRevisionDate: 10 - Dec - 2014; Component Type: Chip Capacitor; MFR Part #: C1608JB0J106K080AB; Part Description: CAP CER 10UF 6.3V 10% JB 0603; Mounting Type: SMT 0603; Datasheet: http://www.tdk.com/pdf/TDKMLCCCapRange.pdf; Height: 0.9mm; Tolerance: 10%; Digikey #: 445-11185-1-ND; PackageReference: 0402
D5 D6 D8 D9 = 5988140107F: LED 0805 Yellow; LastRevisionNote: ImportComponents; Published: 23-Apr-2014; Publisher: UltiMachine; LastRevisionDate: 23-Apr-2014; VALUE: 5988140107F
D7 D10 = SK310A: DIODE Schottky 3A SMA; LastRevisionNote: ImportComponents; LastRevisionDate: 23-Apr-2014; ManufacturerPartNumber: SK310A; Published: 23-Apr-2014; Publisher: UltiMachine
Q3 Q4 = PSMN7R0-60YS: N-Channel MOSFET; Published: 8-Jun-2000; LatestRevisionDate: 17-Jul-2002; LatestRevisionNote: Re-released for DXP Platform.; PackageVersion: 1995/1996; PackageReference: E3; Publisher: Altium Limited; PackageDescription: TO, Flat Index; 3 In-Line, Axial Leads; Body Dia. 4.6mm; Lead Dia. 0.5 mm (max)
R7 R10 R13 R16 = RC0603JR-071K8L: RES 0603 1.8K 100mW 5%; LastRevisionNote: ImportComponents; Published: 23-Apr-2014; Publisher: UltiMachine; LastRevisionDate: 23-Apr-2014; ManufacturerPartNumber: RC0603JR-071K8L; VALUE: 1.8K
R8 R11 R14 R17 = CRCW060310R0FKEA: RES 0603 10r 100mW 1%; LastRevisionNote: ImportComponents; Published: 23-Apr-2014; Publisher: UltiMachine; LastRevisionDate: 23-Apr-2014; ManufacturerPartNumber: CRCW060310R0FKEA; VALUE: 10r
R9 R12 R15 R18 = RC1005F104CS: RES SMD 100K OHM 1% 1/16W 0402; Manufacturer: Samsung; LastRevisionNote: ImportComponents; Digilkey #: 1276-3432-1-ND; Published: 23-Apr-2014; Publisher: UltiMachine; LastRevisionDate: 23-Apr-2014; ManufacturerPartNumber: RC1005F104CS; VALUE: 100K
T2 = con-phoenix-508_4
TP10-TP15 = Socket: LatestRevisionDate: 17-Jul-2002; LatestRevisionNote: Re-released for DXP Platform.; Publisher: Altium Limited
U2 = TXS0104E: TXS0104E - Bidriectional Opendrain/pushpull level shift; MFR: Texas Instruments; MFR Part #: TXS0104ERGYR; Active: Yes; Digikey Part #: 296-20698-2-ND; Height: 1mm; mounting Type: SMD; Datasheet: http://www.ti.com/lit/ds/symlink/txs0104e.pdf; Lead Free ?: RhoS

## Sheet TR.SchDoc
size A
Used 4 times, as channels U_TR1, U_TR2, U_TR3, U_TR4. Parts and nets are listed once, with the designators drawn on the sheet.
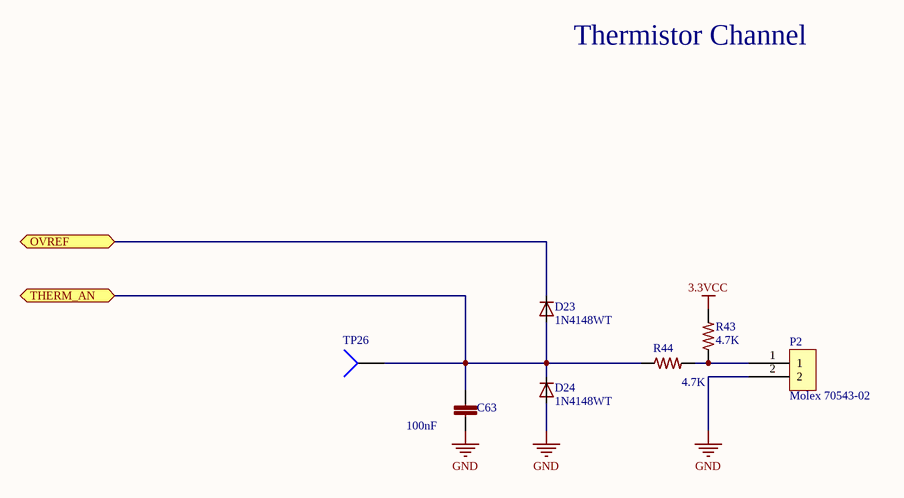
[diagram p5: TR.SchDoc]

### Parts
C63  100nF  [C0402]
D23  1N4148WT  [SOD523]
D24  1N4148WT  [SOD523]
P2  Molex 70543-02  [70543-02]
R43  4.7K  [R0603]
R44  4.7K  [R0603]
TP26  TP4  [TP-2]  (value not drawn)

### Ports
OVREF, THERM_AN

### Nets
3.3VCC: R43.2
GND: C63.2 D24.A P2.2
OVREF: D23.C ; port OVREF
THERM_AN: C63.1 D23.A D24.C R44.1 TP26.1 ; port THERM_AN
NetP2_1: P2.1 R43.1 R44.2

### Channels
U_TR1: designators end in _U_TR1; ports OVREF=NetD18_C THERM_AN=AN1
U_TR2: designators end in _U_TR2; ports OVREF=NetD18_C THERM_AN=AN2
U_TR3: designators end in _U_TR3; ports OVREF=NetD18_C THERM_AN=AN3
U_TR4: designators end in _U_TR4; ports OVREF=NetD18_C THERM_AN=AN4

### Notes on the sheet
- Thermistor Channel

### Library data of the parts
C63 = GRM155R71C104KA88D: as C57 on sheet Sandshark 3D - MCU - ATSAM3X8C; Published: 23-Apr-2014; Publisher: UltiMachine; LastRevisionDate: 23-Apr-2014; ManufacturerPartNumber: GRM155R71C104KA88D; VALUE: 100nF
D23 D24 = 1N4148WT: DIODE SOD523; LastRevisionNote: ImportComponents; Published: 23-Apr-2014; Publisher: UltiMachine; LastRevisionDate: 23-Apr-2014; Value: 1N4148WT
R43 R44 = ERJ3EKF4701V: RES 0603 4.7K 100mW 1%; LastRevisionNote: ImportComponents; Published: 23-Apr-2014; Publisher: UltiMachine; LastRevisionDate: 23-Apr-2014; ManufacturerPartNumber: ERJ3EKF4701V; VALUE: 4.7K
TP26 = Socket: LatestRevisionDate: 17-Jul-2002; LatestRevisionNote: Re-released for DXP Platform.; Publisher: Altium Limited

## Sheet Pwr.SchDoc
size A
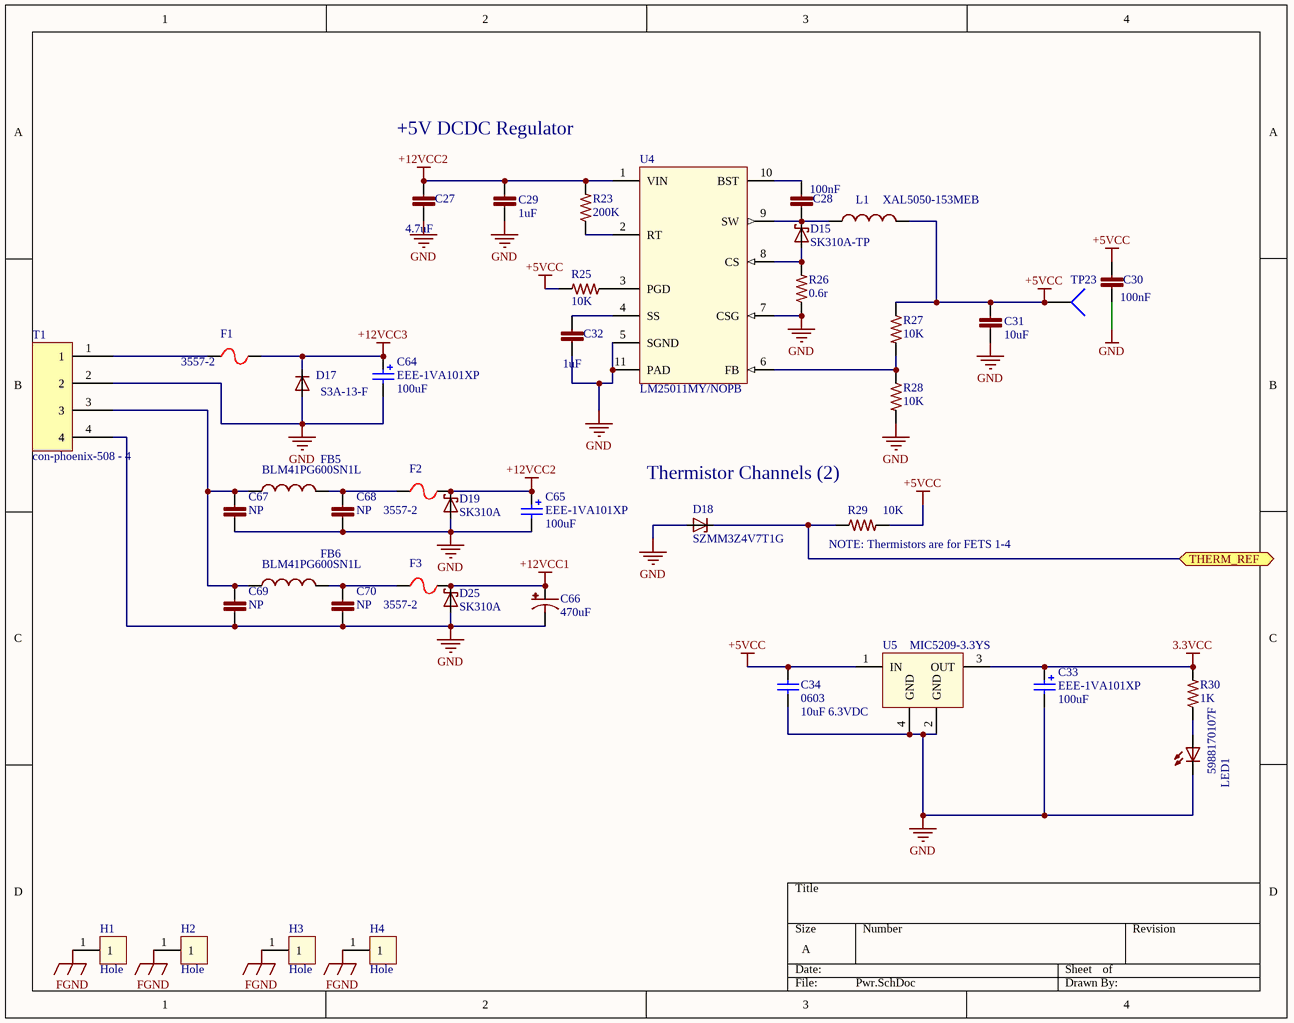
[diagram p6: Pwr.SchDoc]

### Parts
C27  4.7uF  [C1206]
C28  100nF  [C0603]
C29  1uF  [C0805]
C30  100nF  [C0603]
C31  10uF  [C0805]
C32  1uF  [C0402]
C33  EEE-1VA101XP  value 100uF  [EEE-1VA101XP]
C34  0603  value 10uF 6.3VDC  [C0603]
C64  EEE-1VA101XP  value 100uF  [EEE-1VA101XP]
C65  EEE-1VA101XP  value 100uF  [EEE-1VA101XP]
C66  470uF  [C12,5-5]
C67  NP  [C0603]
C68  NP  [C0603]
C69  NP  [C0603]
C70  NP  [C0603]
D15  SK310A-TP  [SMA-SM]
D17  S3A-13-F  [DO-214AB]
D18  SZMM3Z4V7T1G  [SOD323-R]
D19  SK310A  [SMA-SM]
D25  SK310A  [SMA-SM]
F1  3557-2  [3557]
F2  3557-2  [3557]
F3  3557-2  [3557]
FB5  BLM41PG600SN1L  [L1806]
FB6  BLM41PG600SN1L  [L1806]
H1  Hole  [Wave_hole_3x7-singleSided]  (no BOM)
H2  Hole  [Wave_hole_3x7-singleSided]  (no BOM)
H3  Hole  [Wave_hole_3x7-singleSided]  (no BOM)
H4  Hole  [Wave_hole_3x7-singleSided]  (no BOM)
L1  XAL5050-153MEB  [XAL50xx-153]
LED1  5988170107F  [LED2012120]
R23  200K  [R0402]
R25  10K  [R0603]
R26  0.6r  [2512R-0.55]
R27  10K  [R0603]
R28  10K  [R0603]
R29  10K  [R0603]
R30  1K  [R0603]
T1  con-phoenix-508 - 4  [MSTBV4]
TP23  TP4  [TP-2]  (value not drawn)
U4  LM25011MY/NOPB  [VSSOP10]
U5  MIC5209-3.3YS  [SOT230P700X190-4N]

### Ports
THERM_REF

### Nets
3.3VCC: C33.1 R30.2 U5.3(OUT)
+5VCC: C30.1 C31.1 C34.2 L1.2 R25.2 R27.1 R29.2 TP23.1 U5.1(IN)
+12VCC1: C66.1(+) D25.C F3.2
+12VCC2: C27.1 C29.1 C65.1 D19.C F2.2 R23.2 U4.1(VIN)
+12VCC3: C64.1 D17.C F1.2
FGND: H1.1 H2.1 H3.1 H4.1
GND: C27.2 C29.2 C30.2 C31.2 C32.2 C33.2 C34.1 C64.2 C65.2 C66.2(-) C67.2 C68.2 C69.2 C70.2 D17.A D18.A D19.A D25.A LED1.C R26.1 R28.2 T1.2 T1.4 U4.5(SGND) U4.7(CSG) U4.11(PAD) U5.2(GND) U5.4(GND)
NetC28_1: C28.1 U4.10(BST)
NetC28_2: C28.2 D15.C L1.1 U4.9(SW)
NetC32_1: C32.1 U4.4(SS)
NetC67_1: C67.1 C69.1 FB5.1 FB6.1 T1.3
NetC68_1: C68.1 F2.1 FB5.2
NetC70_1: C70.1 F3.1 FB6.2
NetD15_A: D15.A R26.2 U4.8(CS)
NetD18_C: D18.C R29.1 ; port THERM_REF
NetF1_1: F1.1 T1.1
NetLED1_A: LED1.A R30.1
NetR23_1: R23.1 U4.2(RT)
NetR25_1: R25.1 U4.3(PGD)
NetR27_2: R27.2 R28.1 U4.6(FB)

### Notes on the sheet
- +5V DCDC Regulator
- Thermistor Channels (2)
- (near R29) NOTE: Thermistors are for FETS 1-4

### Library data of the parts
C27 = C1206C475K5PACTU: CAP CER 1206 4.7uF 50V 10% X5R; LastRevisionNote: ImportComponents; Published: 23-Apr-2014; Publisher: UltiMachine; LastRevisionDate: 23-Apr-2014; ManufacturerPartNumber: C1206C475K5PACTU; VALUE: 4.7uF
C28 C30 C67-C70 = C0603C104K5RACTU: as C3 on sheet M; Published: 23-Apr-2014; Publisher: UltiMachine; LastRevisionDate: 23-Apr-2014; ManufacturerPartNumber: C0603C104K5RACTU
  C28 C30: VALUE: 100nF
  C67-C70: VALUE: NP
C29 = GRM21BR71H105KA12L: CAP CER 0805 1uF 50V 10% X7R; LastRevisionNote: ImportComponents; Published: 23-Apr-2014; Publisher: UltiMachine; LastRevisionDate: 23-Apr-2014; ManufacturerPartNumber: GRM21BR71H105KA12L; VALUE: 1uF
C31 = C0805C106K8PACTU: CAP CER 0805 10uF 10V 10% X5R; LastRevisionNote: ImportComponents; Published: 23-Apr-2014; Publisher: UltiMachine; LastRevisionDate: 23-Apr-2014; ManufacturerPartNumber: C0805C106K8PACTU; VALUE: 10uF
C32 = GRM155R60J105KE19D: CAP CER 0402 1uF 6.3V 10% X5R; LastRevisionNote: ImportComponents; Published: 23-Apr-2014; Publisher: UltiMachine; LastRevisionDate: 23-Apr-2014; ManufacturerPartNumber: GRM155R60J105KE19D; VALUE: 1uF
C33 C64 C65 = EEE-1VA101XP: CAP ALUM 100UF 35V 20% SMD; Manufacture: Panasonic; Digikey Part #: PCE3951CT-ND; Price: $0.63; Mount Type: SMT Panasonic VS D Series; Status: Active; Height: 7.70mm; Datasheet: http://industrial.panasonic.com/www-cgi/jvcr13pz.cgi?E+PZ+3+ABA0002+EEE1VA101XP+7+WW; Manufacture Part #: EEE-1VA101XP
C34 = C1608JB0J106K080AB: as C15 on sheet MOSFETs and Driver; Published: 10 - Dec - 2014; LatestRevisionDate: 10 - Dec - 2014; Component Type: Chip Capacitor; MFR Part #: C1608JB0J106K080AB; Part Description: CAP CER 10UF 6.3V 10% JB 0603; Mounting Type: SMT 0603; Datasheet: http://www.tdk.com/pdf/TDKMLCCCapRange.pdf; Height: 0.9mm; Tolerance: 10%; Digikey #: 445-11185-1-ND; PackageReference: 0402
C66 = UPW1H471MHD1TO: CAP ALU 470uF 50V 20%; LastRevisionNote: ImportComponents; Published: 23-Apr-2014; Publisher: UltiMachine; LastRevisionDate: 23-Apr-2014; ManufacturerPartNumber: UPW1H471MHD1TO; VALUE: 470uF
D15 D19 D25 = SK310A: as D7 on sheet MOSFETs and Driver; LastRevisionDate: 23-Apr-2014; ManufacturerPartNumber: SK310A; Published: 23-Apr-2014; Publisher: UltiMachine
D17 = S3A-13-F: DIODE DO-214AB; LastRevisionNote: ImportComponents; Published: 23-Apr-2014; Publisher: UltiMachine; LastRevisionDate: 23-Apr-2014; Value: S3A-13-F
D18 = SZMM3Z4V7T1G: Z-Diode; Manufacturer: Fairchild; LastRevisionNote: ImportComponents; Published: 23-Apr-2014; Publisher: UltiMachine; LastRevisionDate: 23-Apr-2014
F1-F3 = 3557-2: FUSE PTH ATO; LastRevisionNote: ImportComponents; Published: 23-Apr-2014; Publisher: UltiMachine; LastRevisionDate: 23-Apr-2014; ManufacturerPartNumber: 3557-2
FB5 FB6 = BLM41PG600SN1L: FERRITE BEAD 1806 60ohm; LastRevisionNote: ImportComponents; Published: 23-Apr-2014; Publisher: UltiMachine; LastRevisionDate: 23-Apr-2014; ManufacturerPartNumber: BLM41PG600SN1L
L1 = XAL5050-153MEB: IND 15uH 3.9A 20%; LastRevisionNote: ImportComponents; Published: 23-Apr-2014; Publisher: UltiMachine; LastRevisionDate: 23-Apr-2014; ManufacturerPartNumber: XAL5050-153MEB; Value: XAL5050-153MEB
LED1 = 5988170107F: LED 0805 Green; LastRevisionNote: ImportComponents; Published: 23-Apr-2014; Publisher: UltiMachine; LastRevisionDate: 23-Apr-2014; VALUE: 5988170107F
R23 = CRCW0402200KFKED: RES 0402 22r 63mW 1%; LastRevisionNote: ImportComponents; Published: 23-Apr-2014; Publisher: UltiMachine; LastRevisionDate: 23-Apr-2014; ManufacturerPartNumber: CRCW0402200KFKED; VALUE: 200K
R25 R27-R29 = ERJ-3EKF1002V: as R34 on sheet Sandshark 3D - MCU - ATSAM3X8C; Published: 23-Apr-2014; Publisher: UltiMachine; LastRevisionDate: 23-Apr-2014; ManufacturerPartNumber: ERJ-3EKF1002V; VALUE: 10K
R26 = RL2512FK-070R06L: RES 0.06 OHM 1W 1% 2512 SMD; LastRevisionNote: ImportComponents; Published: 23-Apr-2014; Publisher: UltiMachine; LastRevisionDate: 23-Apr-2014; ManufacturerPartNumber: RL2512FK-070R06L; VALUE: 0.6r
R30 = ERJ-3EKF1001V: RES 0603 1K 100mW 1%; LastRevisionNote: ImportComponents; Published: 23-Apr-2014; Publisher: UltiMachine; LastRevisionDate: 23-Apr-2014; ManufacturerPartNumber: ERJ-3EKF1001V; VALUE: 1K
T1 = con-phoenix-508_4
TP23 = Socket: LatestRevisionDate: 17-Jul-2002; LatestRevisionNote: Re-released for DXP Platform.; Publisher: Altium Limited
U4 = LM25011: REG BUCK; Value: LM25011MY/NOPB

## Nets that join several sheets
3.3VCC: Sandshark 3D - MCU - ATSAM3X8C (18 pins), MZ (C24.1 C25.1 U3.16 U3.17), M1 (C10_M1.1 C11_M1.1 U1_M1.16 U1_M1.17), M2 (C10_M2.1 C11_M2.1 U1_M2.16 U1_M2.17), M3 (C10_M3.1 C11_M3.1 U1_M3.16 U1_M3.17), ES1 (MAX1_ES1.3 MIN1_ES1.3 R1_ES1.2 R2_ES1.2), ES2 (MAX1_ES2.3 MIN1_ES2.3 R1_ES2.2 R2_ES2.2), ES3 (MAX1_ES3.3 MIN1_ES3.3 R1_ES3.2 R2_ES3.2), MOSFETs and Driver (C13.2 C16.2 U2.1), U_TR1 (R43_U_TR1.2), U_TR2 (R43_U_TR2.2), U_TR3 (R43_U_TR3.2), U_TR4 (R43_U_TR4.2), Pwr (C33.1 R30.2 U5.3)
+5VCC: Sandshark 3D - MCU - ATSAM3X8C (EXP1.10), MOSFETs and Driver (C14.2 C15.2 U2.14), Pwr (9 pins)
+12VCC1: MZ (C17.1 R19.2 U3.4 U3.11), M1 (C3_M1.2 R3_M1.2 U1_M1.4 U1_M1.11), M2 (C3_M2.2 R3_M2.2 U1_M2.4 U1_M2.11), M3 (C3_M3.2 R3_M3.2 U1_M3.4 U1_M3.11), Pwr (C66.1 D25.C F3.2)
+12VCC2: MOSFETs and Driver (7 pins), Pwr (7 pins)
+12VCC3: MOSFETs and Driver (D10.C R16.2 T2.2), Pwr (C64.1 D17.C F1.2)
FGND: Sandshark 3D - MCU - ATSAM3X8C (D22.C S1.3 S1.4), Pwr (H1.1 H2.1 H3.1 H4.1)
GND: Sandshark 3D - MCU - ATSAM3X8C (40 pins), MZ (13 pins), M1 (13 pins), M2 (13 pins), M3 (13 pins), ES1 (5 pins), ES2 (5 pins), ES3 (5 pins), MOSFETs and Driver (18 pins), U_TR1 (C63_U_TR1.2 D24_U_TR1.A P2_U_TR1.2), U_TR2 (C63_U_TR2.2 D24_U_TR2.A P2_U_TR2.2), U_TR3 (C63_U_TR3.2 D24_U_TR3.A P2_U_TR3.2), U_TR4 (C63_U_TR4.2 D24_U_TR4.A P2_U_TR4.2), Pwr (28 pins)
DIR1: Sandshark 3D - MCU - ATSAM3X8C (U6.59), M1 (TP8_M1.1 U1_M1.20)
DIR2: Sandshark 3D - MCU - ATSAM3X8C (U6.82), M2 (TP8_M2.1 U1_M2.20)
DIR3: Sandshark 3D - MCU - ATSAM3X8C (U6.99), M3 (TP8_M3.1 U1_M3.20)
DIR_Z: Sandshark 3D - MCU - ATSAM3X8C (U6.88), MZ (TP21.1 U3.20)
EN1: Sandshark 3D - MCU - ATSAM3X8C (U6.58), M1 (TP4_M1.1 U1_M1.21)
EN2: Sandshark 3D - MCU - ATSAM3X8C (U6.81), M2 (TP4_M2.1 U1_M2.21)
EN3: Sandshark 3D - MCU - ATSAM3X8C (U6.97), M3 (TP4_M3.1 U1_M3.21)
EN_Z: Sandshark 3D - MCU - ATSAM3X8C (U6.87), MZ (TP17.1 U3.21)
FAN0_PWM: Sandshark 3D - MCU - ATSAM3X8C (U6.49), MOSFETs and Driver (R9.2 TP10.1 U2.2)
FAN1_PWM: Sandshark 3D - MCU - ATSAM3X8C (U6.50), MOSFETs and Driver (R12.2 TP11.1 U2.3)
HEATBED_PWM: Sandshark 3D - MCU - ATSAM3X8C (U6.7), MOSFETs and Driver (R18.2 TP15.1 U2.5)
HEATER_PWM: Sandshark 3D - MCU - ATSAM3X8C (U6.17), MOSFETs and Driver (R15.2 TP13.1 U2.4)
MAX_ES1: Sandshark 3D - MCU - ATSAM3X8C (U6.6), ES1 (5 pins)
MAX_ES2: Sandshark 3D - MCU - ATSAM3X8C (U6.4), ES2 (5 pins)
MAX_ES3: Sandshark 3D - MCU - ATSAM3X8C (U6.2), ES3 (5 pins)
MIN_ES1: Sandshark 3D - MCU - ATSAM3X8C (U6.5), ES1 (5 pins)
MIN_ES2: Sandshark 3D - MCU - ATSAM3X8C (U6.3), ES2 (5 pins)
MIN_ES3: Sandshark 3D - MCU - ATSAM3X8C (U6.1), ES3 (5 pins)
MOD0E1: Sandshark 3D - MCU - ATSAM3X8C (U6.56), M1 (TP7_M1.1 U1_M1.24)
MOD0E2: Sandshark 3D - MCU - ATSAM3X8C (U6.62), M2 (TP7_M2.1 U1_M2.24)
MOD0E3: Sandshark 3D - MCU - ATSAM3X8C (U6.94), M3 (TP7_M3.1 U1_M3.24)
MOD0E_Z: Sandshark 3D - MCU - ATSAM3X8C (U6.85), MZ (TP20.1 U3.24)
MOD1E1: Sandshark 3D - MCU - ATSAM3X8C (U6.55), M1 (TP6_M1.1 U1_M1.25)
MOD1E2: Sandshark 3D - MCU - ATSAM3X8C (U6.61), M2 (TP6_M2.1 U1_M2.25)
MOD1E3: Sandshark 3D - MCU - ATSAM3X8C (U6.93), M3 (TP6_M3.1 U1_M3.25)
MOD1E_Z: Sandshark 3D - MCU - ATSAM3X8C (U6.84), MZ (TP19.1 U3.25)
MOD2E1: Sandshark 3D - MCU - ATSAM3X8C (U6.54), M1 (TP5_M1.1 U1_M1.26)
MOD2E2: Sandshark 3D - MCU - ATSAM3X8C (U6.60), M2 (TP5_M2.1 U1_M2.26)
MOD2E3: Sandshark 3D - MCU - ATSAM3X8C (U6.92), M3 (TP5_M3.1 U1_M3.26)
MOD2E_Z: Sandshark 3D - MCU - ATSAM3X8C (U6.83), MZ (TP18.1 U3.26)
NetD18_C: U_TR1 (D23_U_TR1.C), U_TR2 (D23_U_TR2.C), U_TR3 (D23_U_TR3.C), U_TR4 (D23_U_TR4.C), Pwr (D18.C R29.1)
REF1: Sandshark 3D - MCU - ATSAM3X8C (U6.66), M1 (R4_M1.1)
REF2: Sandshark 3D - MCU - ATSAM3X8C (U6.67), M2 (R4_M2.1)
REF3: Sandshark 3D - MCU - ATSAM3X8C (U6.63), M3 (R4_M3.1)
REF_Z: Sandshark 3D - MCU - ATSAM3X8C (U6.68), MZ (R20.1)
STEP1: Sandshark 3D - MCU - ATSAM3X8C (U6.57), M1 (TP9_M1.1 U1_M1.22)
STEP2: Sandshark 3D - MCU - ATSAM3X8C (U6.80), M2 (TP9_M2.1 U1_M2.22)
STEP3: Sandshark 3D - MCU - ATSAM3X8C (U6.96), M3 (TP9_M3.1 U1_M3.22)
STEP_Z: Sandshark 3D - MCU - ATSAM3X8C (U6.86), MZ (TP22.1 U3.22)